# EAGLE schematic Sound_pollution (EAGLE 9.5.2)
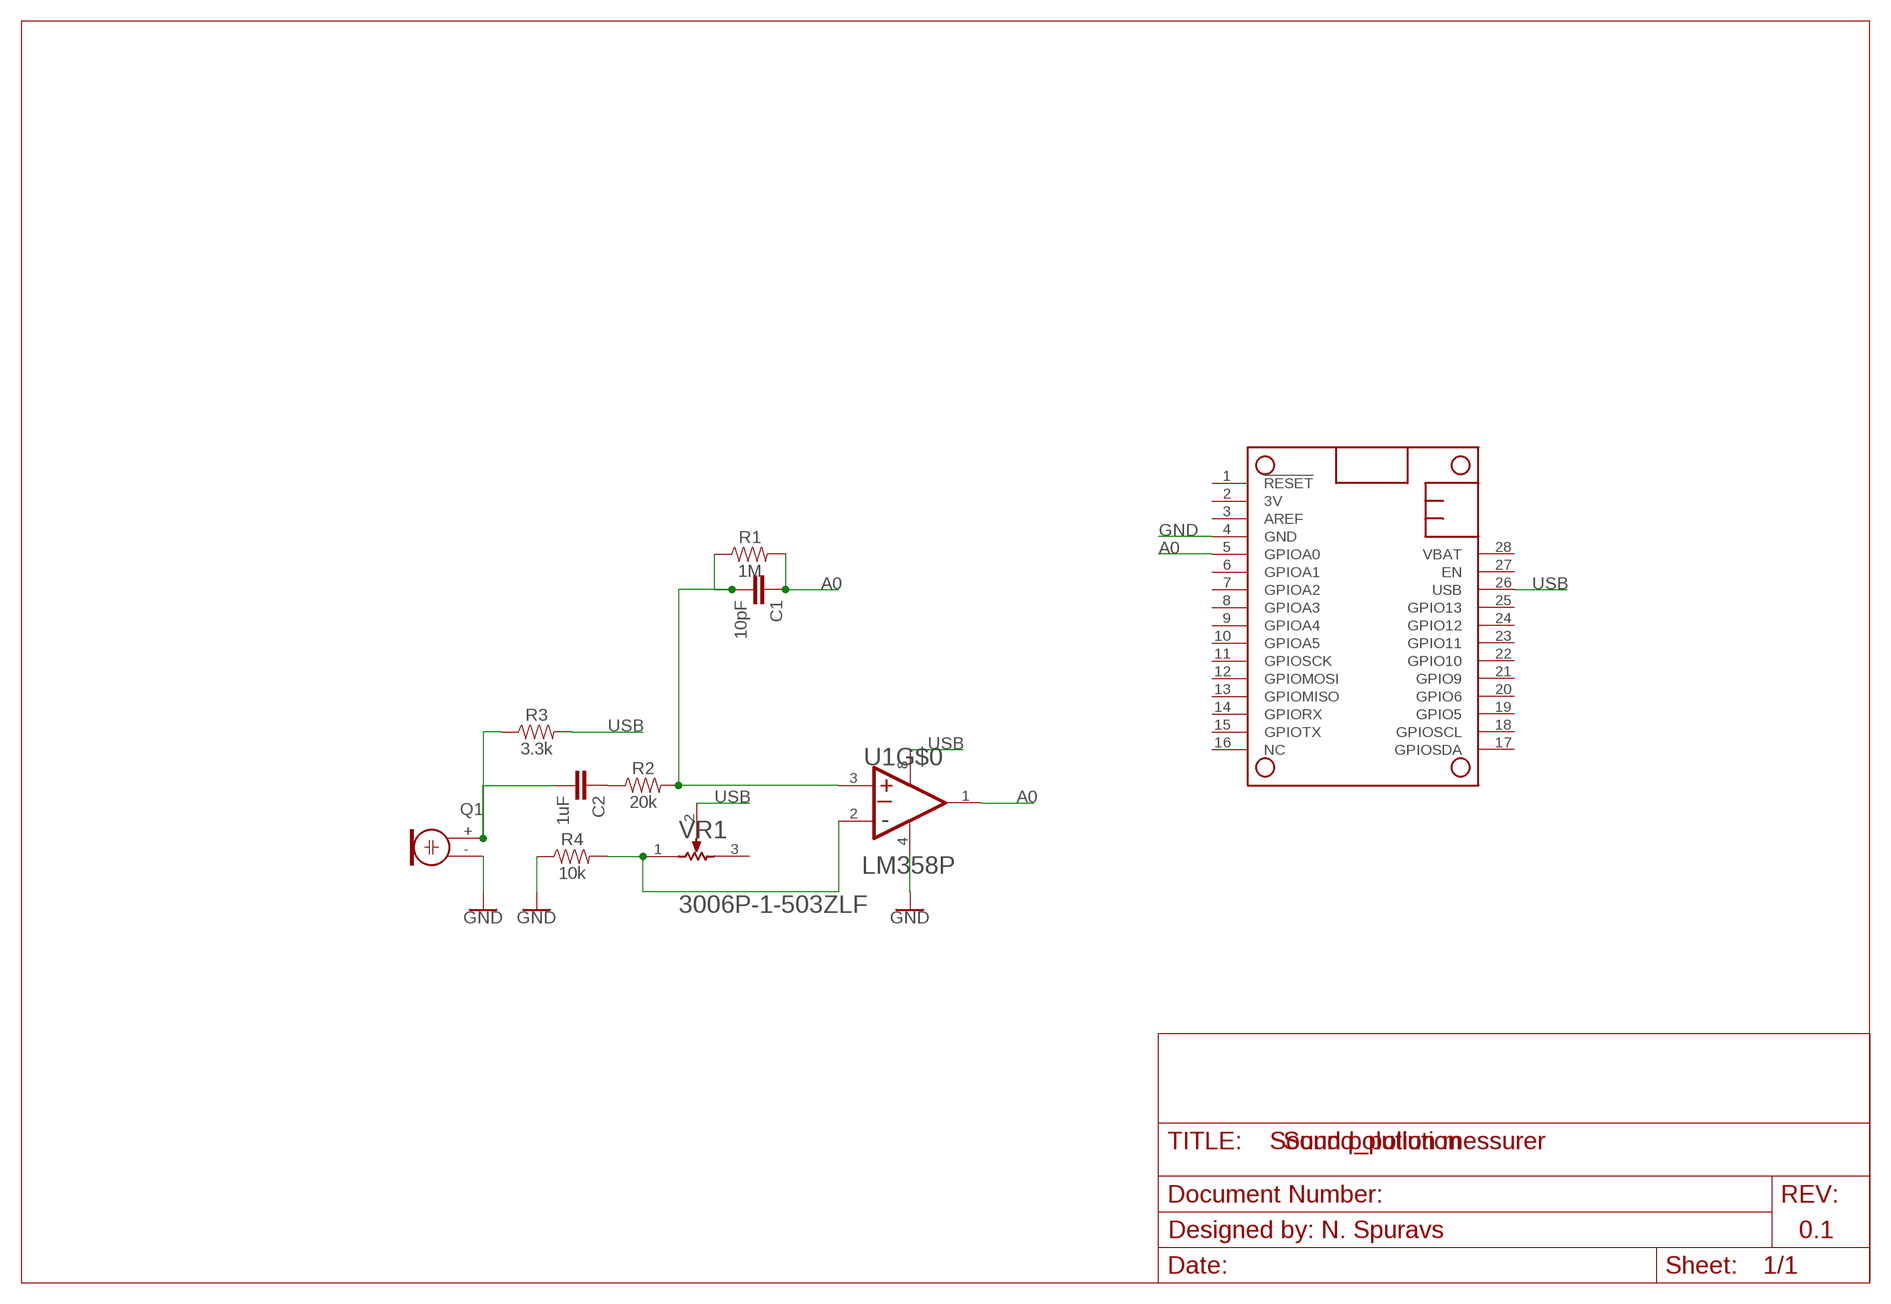
[diagram p0: schematic, sheet 1]

## Parts
C1  10pF  10NF-PTH-10MM-10000V-1-%  [CAP-PTH-10MM]
C2  1uF  10NF-PTH-10MM-10000V-1-%  [CAP-PTH-10MM]
MS1  FEATHERWING  [FEATHERWING]
Q1  ELECTRET  [9.7ELECTRET]
R1  1M  1KOHM-HORIZ-1/4W-1%  [AXIAL-0.3]
R2  20k  1KOHM-HORIZ-1/4W-1%  [AXIAL-0.3]
R3  3.3k  1KOHM-HORIZ-1/4W-1%  [AXIAL-0.3]
R4  10k  1KOHM-HORIZ-1/4W-1%  [AXIAL-0.3]
U1  TEXAS_INSTRUMENTS_LM358PTEXAS_INSTRUMENTS_LM358P_0_0  [TEXAS_INSTRUMENTS_LM358P_0]
VR1  BOURNS_3006P-1-503ZLFBOURNS_3006P-1-503ZLF_0_0  [BOURNS_3006P-1-503ZLF_0]

## Nets
A0: C1.1 MS1.5(GPIOA0) R1.P$2 U1.1(1OUT)
GND: MS1.4(GND) Q1.- R4.P$1 U1.4(GND)
N$1: R4.P$2 U1.2(1IN-) VR1.1(CCW)
N$2: C2.2 Q1.+ R3.P$1
N$3: C2.1 R2.P$1
PIN3: C1.2 R1.P$1 R2.P$2 U1.3(1IN+)
USB: MS1.26(USB) R3.P$2 U1.8(VCC) VR1.2(WIPER)
Unconnected: MS1.1(!RESET) MS1.2(3V) MS1.3(AREF) MS1.6(GPIOA1) MS1.7(GPIOA2) MS1.8(GPIOA3) MS1.9(GPIOA4) MS1.10(GPIOA5) MS1.11(GPIOSCK) MS1.12(GPIOMOSI) MS1.13(GPIOMISO) MS1.14(GPIORX) MS1.15(GPIOTX) MS1.16(NC) MS1.17(GPIOSDA) MS1.18(GPIOSCL) MS1.19(GPIO5) MS1.20(GPIO6) MS1.21(GPIO9) MS1.22(GPIO10) MS1.23(GPIO11) MS1.24(GPIO12) MS1.25(GPIO13) MS1.27(EN) MS1.28(VBAT) U1.5(2IN+) U1.6(2IN-) U1.7(2OUT) VR1.3(CW)

## Notes on the sheet
- Sound polution messurer
- Designed by: N. Spuravs | 0.1

## Library data of the parts
C1 C2 = SparkFun-Capacitors:10NF: 0.01uF/10nF/10,000pF ceramic capacitors A capacitor is a passive two-terminal electrical component used to store electrical energy temporarily in an electric field. CAP-09321; PROD_ID: CAP-09321; VALUE: 10nF
MS1 = adafruit:FEATHERWING
Q1 = adafruit:ELECTRET: Electret microphone Thru hole 2.54mm spacing with 9.7mm diameter
R1-R4 = SparkFun-Resistors:1KOHM: 1kΩ resistor A resistor is a passive two-terminal electrical component that implements electrical resistance as a circuit element. Resistors act to reduce current flow, and, at the same time, act to lower voltage levels within circuits. - Wikipedia; PROD_ID: RES-12182; VALUE: 1k
U1 = Texas Instruments - LM358P:TEXAS_INSTRUMENTS_LM358P: Dual Operational Amplifiers; CENTROID_NOT_SPECIFIED: No; DATASHEET: http://www.ti.com/lit/ds/symlink/lm358.pdf; DIGIKEY_DESCRIPTION: IC General Purpose Amplifier 2 Circuit 8-PDIP; DIGIKEY_PART_NUMBER: 296-1395-5-ND; IPC_LAND_PATTERN_NAME: DIP794W46P254L959H508Q8; LEAD_FREE: yes; MF: Texas Instruments; MFG_PACKAGE_IDENT: P (R-PDIP-T8); MOUSER_PART_NUMBER: 595-LM358P; MPN: LM358P; PACKAGE: PDIP8; PREFIX: U; ROHS: yes; TEMPERATURE_RANGE_HIGH: +70°C; TEMPERATURE_RANGE_LOW: 0°C
VR1 = Bourns - 3006P-1-503ZLF:BOURNS_3006P-1-503ZLF: BOUR-3006P-3; CIIVA_IDS: 1585578; COMPONENT_LINK_1_DESCRIPTION: Manufacturer URL; COMPONENT_LINK_1_URL: http://www.bourns.com/; COMPONENT_LINK_3_DESCRIPTION: Package Specification; COMPONENT_LINK_3_URL: http://www.bourns.com/data/global/pdfs/3006.pdf; DATASHEET: http://www.bourns.com/data/global/pdfs/3006.pdf; DATASHEET_VERSION: Apr-14; FOOTPRINT_VARIANT_NAME_0: Manufacturer Recommended; IMPORTED: yes; IMPORTED_FROM: vault; IMPORT_TS: 1521842261; MF: Bourns; MOUNTING_TECHNOLOGY: Through Hole; MPN: 3006P-1-503ZLF; NUMBER_OF_TURNS: 15; PACKAGE: 3006P-3; PACKAGE_DESCRIPTION: 3-Pin THD, Body 19.05 x 4.83 mm, Height 6.6 mm; PACKAGE_VERSION: Apr-14; PREFIX: VR; RELEASE_DATE: 1401875105; RESISTANCE_KOHM: 50; RESISTANCE_TOLERANCE: +/- 10%; ROHS: Yes; ROTATIONAL_LIFE: 200 Cycles; TEMPERATURE_RANGE: -55 to 125 degC; VAULT_GUID: 285C054A-95B7-454E-B5CD-07F8FCE4BB75; VAULT_REVISION: 11112835-5273-40EB-B951-B9FC8AC5A5FF